# EAGLE design eclaire sub board (EAGLE 7.2.0)
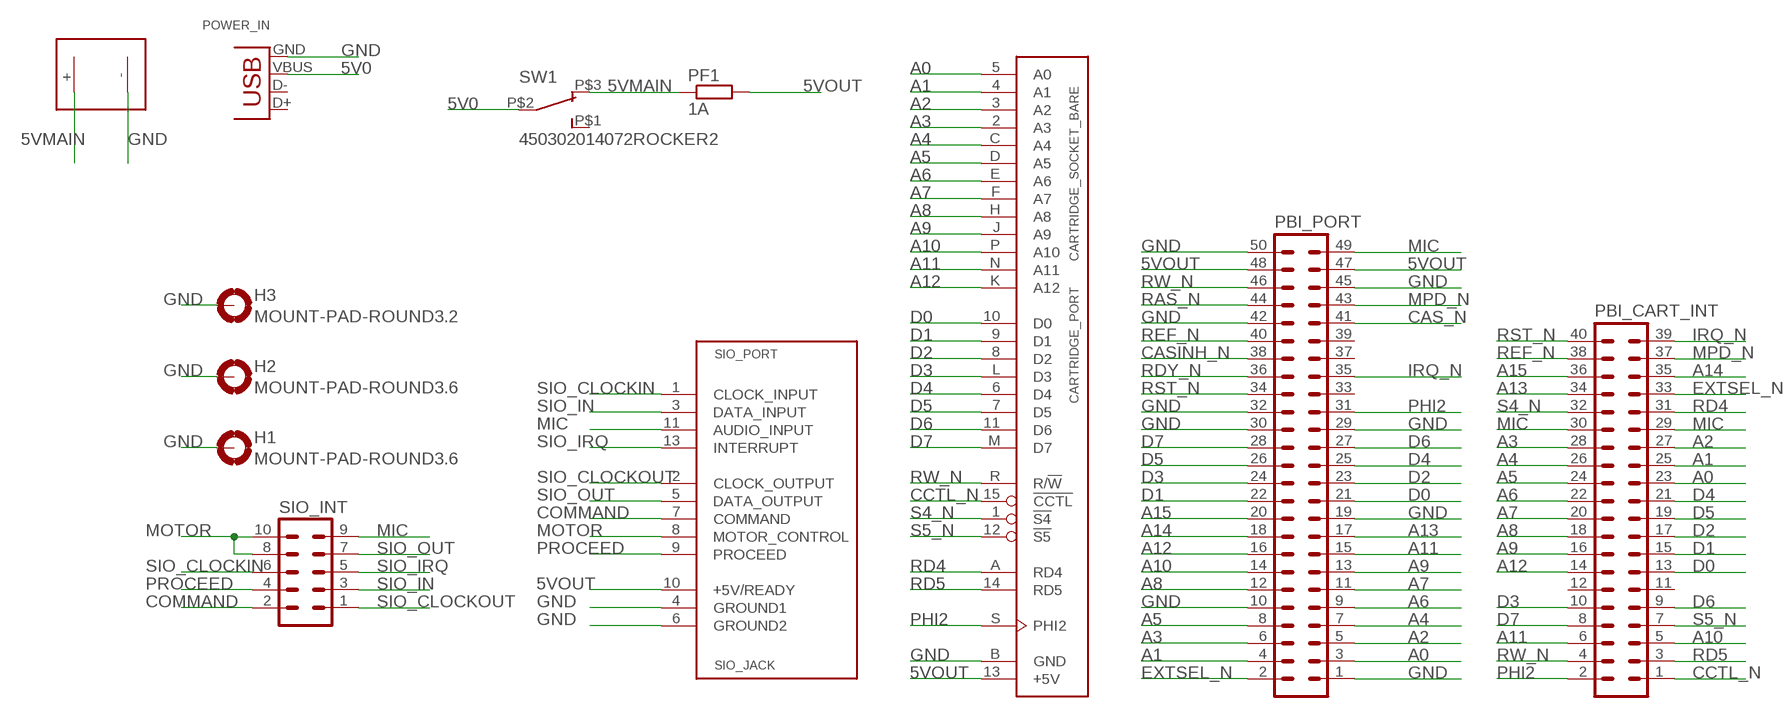
[diagram p0: schematic, sheet 1]

## Parts
CARTRIDGE_PORT  CARTRIDGE_SOCKET_BARE  [CARTRIDGE_SOCKET]
H1  MOUNT-PAD-ROUND3.6  [3,6-PAD]
H2  MOUNT-PAD-ROUND3.6  [3,6-PAD]
H3  MOUNT-PAD-ROUND3.2  [3,2-PAD]
PBI_CART_INT  ML40  [ML40]
PBI_PORT  ML50  [ML50]
PF1  1A  R-EU_R1206  [R1206]
POWER_IN  USB-B-H  [USB-B-H]
SIO_INT  ML10  [ML10]
SIO_PORT  SIO_JACK  [SIO_JACK]
SW1  450302014072ROCKER2  [ROCKER_VERT_SPDT2]
U$6  MOLEX_PS  [MOLEX_PS]

## Nets
5V0 [5V0]: POWER_IN.VBUS SW1.P$2
5VMAIN [5VMAIN]: PF1.1 SW1.P$3 U$6.+
5VOUT [5VOUT]: CARTRIDGE_PORT.13(+5V) PBI_PORT.47 PBI_PORT.48 PF1.2 SIO_PORT.10(+5V/READY)
A0: CARTRIDGE_PORT.5(A0) PBI_CART_INT.23 PBI_PORT.3
A1: CARTRIDGE_PORT.4(A1) PBI_CART_INT.25 PBI_PORT.4
A2: CARTRIDGE_PORT.3(A2) PBI_CART_INT.27 PBI_PORT.5
A3: CARTRIDGE_PORT.2(A3) PBI_CART_INT.28 PBI_PORT.6
A4: CARTRIDGE_PORT.C(A4) PBI_CART_INT.26 PBI_PORT.7
A5: CARTRIDGE_PORT.D(A5) PBI_CART_INT.24 PBI_PORT.8
A6: CARTRIDGE_PORT.E(A6) PBI_CART_INT.22 PBI_PORT.9
A7: CARTRIDGE_PORT.F(A7) PBI_CART_INT.20 PBI_PORT.11
A8: CARTRIDGE_PORT.H(A8) PBI_CART_INT.18 PBI_PORT.12
A9: CARTRIDGE_PORT.J(A9) PBI_CART_INT.16 PBI_PORT.13
A10: CARTRIDGE_PORT.P(A10) PBI_CART_INT.5 PBI_PORT.14
A11: CARTRIDGE_PORT.N(A11) PBI_CART_INT.6 PBI_PORT.15
A12: CARTRIDGE_PORT.K(A12) PBI_CART_INT.14 PBI_PORT.16
A13: PBI_CART_INT.34 PBI_PORT.17
A14: PBI_CART_INT.35 PBI_PORT.18
A15: PBI_CART_INT.36 PBI_PORT.20
CAS_N: PBI_PORT.41
CASINH_N: PBI_PORT.38
CCTL_N: CARTRIDGE_PORT.15(!CCTL) PBI_CART_INT.1
COMMAND: SIO_INT.2 SIO_PORT.7(COMMAND)
D0: CARTRIDGE_PORT.10(D0) PBI_CART_INT.13 PBI_PORT.21
D1: CARTRIDGE_PORT.9(D1) PBI_CART_INT.15 PBI_PORT.22
D2: CARTRIDGE_PORT.8(D2) PBI_CART_INT.17 PBI_PORT.23
D3: CARTRIDGE_PORT.L(D3) PBI_CART_INT.10 PBI_PORT.24
D4: CARTRIDGE_PORT.6(D4) PBI_CART_INT.21 PBI_PORT.25
D5: CARTRIDGE_PORT.7(D5) PBI_CART_INT.19 PBI_PORT.26
D6: CARTRIDGE_PORT.11(D6) PBI_CART_INT.9 PBI_PORT.27
D7: CARTRIDGE_PORT.M(D7) PBI_CART_INT.8 PBI_PORT.28
EXTSEL_N: PBI_CART_INT.33 PBI_PORT.2
GND: CARTRIDGE_PORT.B(GND) H1.B3,6(MOUNT) H2.B3,6(MOUNT) H3.B3,2(MOUNT) PBI_PORT.1 PBI_PORT.10 PBI_PORT.19 PBI_PORT.29 PBI_PORT.30 PBI_PORT.32 PBI_PORT.42 PBI_PORT.45 PBI_PORT.50 POWER_IN.GND SIO_PORT.4(GROUND1) SIO_PORT.6(GROUND2) U$6.-(--)
IRQ_N: PBI_CART_INT.39 PBI_PORT.35
MIC: PBI_CART_INT.29 PBI_CART_INT.30 PBI_PORT.49 SIO_INT.9 SIO_PORT.11(AUDIO_INPUT)
MOTOR: SIO_INT.8 SIO_INT.10 SIO_PORT.8(MOTOR_CONTROL)
MPD_N: PBI_CART_INT.37 PBI_PORT.43
PHI2: CARTRIDGE_PORT.S(PHI2) PBI_CART_INT.2 PBI_PORT.31
PROCEED: SIO_INT.4 SIO_PORT.9(PROCEED)
RAS_N: PBI_PORT.44
RD4: CARTRIDGE_PORT.A(RD4) PBI_CART_INT.31
RD5: CARTRIDGE_PORT.14(RD5) PBI_CART_INT.3
RDY_N: PBI_PORT.36
REF_N: PBI_CART_INT.38 PBI_PORT.40
RST_N: PBI_CART_INT.40 PBI_PORT.34
RW_N: CARTRIDGE_PORT.R(R/!W) PBI_CART_INT.4 PBI_PORT.46
S4_N: CARTRIDGE_PORT.1(!S4) PBI_CART_INT.32
S5_N: CARTRIDGE_PORT.12(!S5) PBI_CART_INT.7
SIO_CLOCKIN: SIO_INT.6 SIO_PORT.1(CLOCK_INPUT)
SIO_CLOCKOUT: SIO_INT.1 SIO_PORT.2(CLOCK_OUTPUT)
SIO_IN: SIO_INT.3 SIO_PORT.3(DATA_INPUT)
SIO_IRQ: SIO_INT.5 SIO_PORT.13(INTERRUPT)
SIO_OUT: SIO_INT.7 SIO_PORT.5(DATA_OUTPUT)
Unconnected: PBI_CART_INT.11 PBI_CART_INT.12 PBI_PORT.33 PBI_PORT.37 PBI_PORT.39 POWER_IN.D+ POWER_IN.D- SW1.P$1

## Library data of the parts
CARTRIDGE_PORT = atari:CARTRIDGE_SOCKET: Cartridge Socket
H1-H3 = holes:MOUNT-PAD-ROUND: MOUNTING PAD, round
PBI_CART_INT = con-ml:ML40: HARTING; OC_FARNELL: unknown; OC_NEWARK: unknown
PBI_PORT = con-ml:ML50: HARTING; OC_FARNELL: unknown; OC_NEWARK: unknown
PF1 = rcl:R-EU_: RESISTOR, European symbol
POWER_IN = con-usb-3:USB: USB Connectors
SIO_INT = con-ml:ML10: HARTING; OC_FARNELL: unknown; OC_NEWARK: unknown
SIO_PORT = atari:SIO_JACK: SIO Jack
SW1 = Eagle_Wuerth_Elektronik_Switch_rev15b:450302014072: WS-SUT, 10mm*2.5mm, SPDT, ON-ON, 2.54mm, right angle type, THT, Mini Slide Switch, 3 pins
U$6 = molex_ps:MOLEX_PS

## Net classes
1 5V0: width 0.61 mm
2 5VOUT: width 0.406 mm
3 5VMAIN: width 0.61 mm

## Board
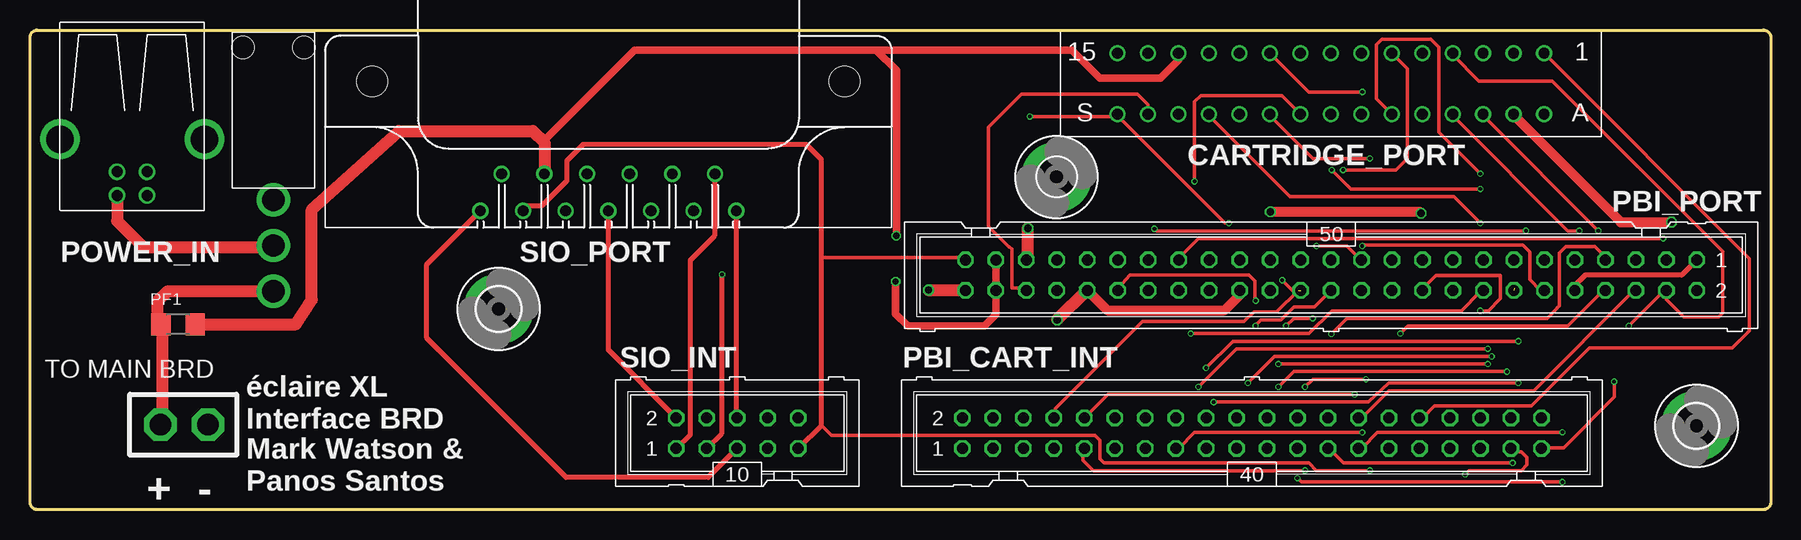
[diagram p1: board, top side]
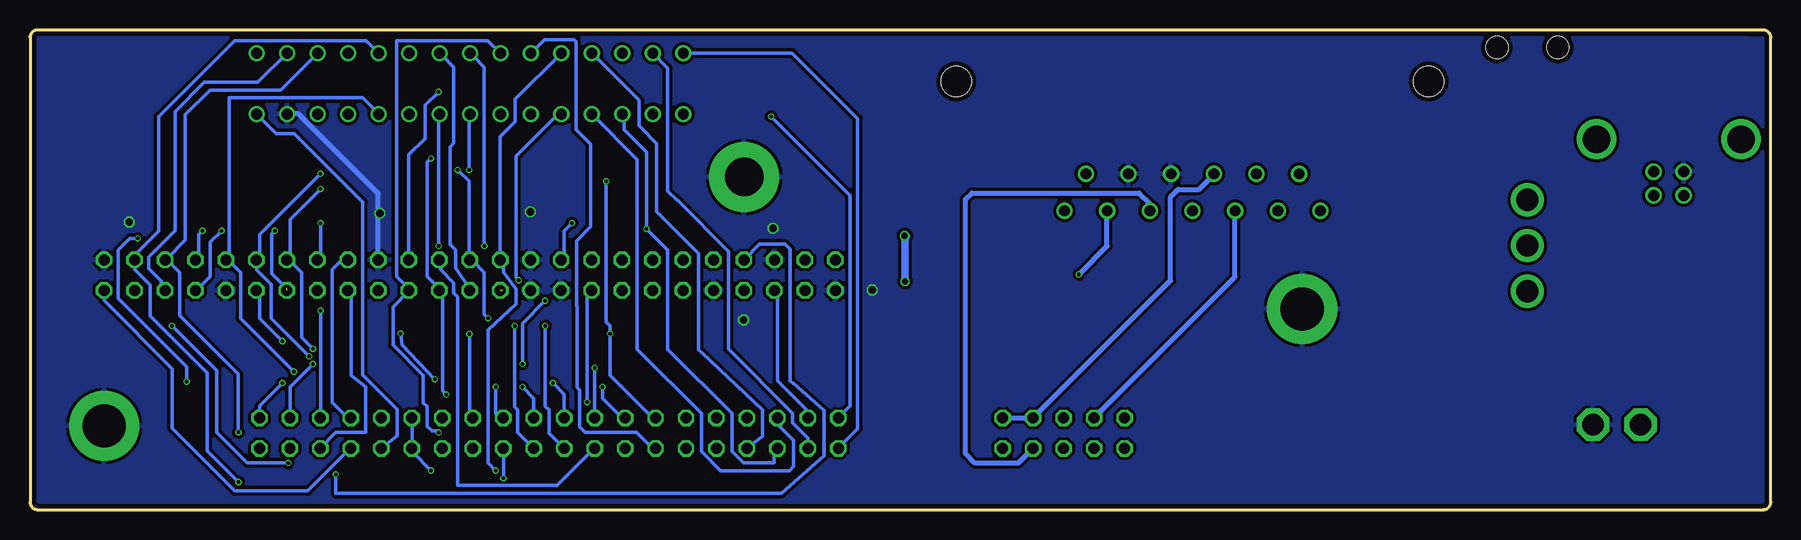
[diagram p2: board, bottom side, seen from below]

Size 145.11 x 40.01 mm. Coordinates in mm from the lower left corner, seen from the top.
Outline: 0.63,40.01 144.47,40.01 arc-90 145.11,39.37 145.11,0.64 arc-90 144.47,0 0.63,0 arc-90 0,0.64 0,39.37 arc-90 0.63,40.01
Copper layers (1*2*15*16): Top 0.035559375mm / dielectric 0.17018125mm / Route2 0.01778125mm / dielectric 47mil / Route15 0.01778125mm / dielectric 0.17018125mm / Bottom 0.035559375mm
Design rules "OSHPark-4layer *": minimum track width 12mil, minimum drill 12mil, track to track 6mil, track to pad 6mil, pad to pad 6mil, via to via 6mil, smd to smd 5mil, copper to edge 15mil, drill to drill 6mil, minimum pad ring 4mil, minimum via ring 4mil, stop-mask expansion 4mil, vias tented up to drill 10mil, thermal gap 10mil

### Footprints (pad centres in the part's own frame; a part is rotated, then mirrored left to right if it is on the bottom)
CARTRIDGE_SOCKET = drill 0.9: 1 17.78,2.54; 2 15.24,2.54; 3 12.7,2.54; 4 10.16,2.54; 5 7.62,2.54; 6 5.08,2.54; 7 2.54,2.54; 8 0,2.54; 9 -2.54,2.54; 10 -5.08,2.54; 11 -7.62,2.54; 12 -10.16,2.54; 13 -12.7,2.54; 14 -15.24,2.54; 15 -17.78,2.54; A 17.78,-2.54; B 15.24,-2.54; C 12.7,-2.54; D 10.16,-2.54; E 7.62,-2.54; F 5.08,-2.54; H 2.54,-2.54; J 0,-2.54; K -2.54,-2.54; L -5.08,-2.54; M -7.62,-2.54; N -10.16,-2.54; P -12.7,-2.54; R -15.24,-2.54; S -17.78,-2.54
3,6-PAD = drill 3.6 pad 5.842: B3,6 0,0
3,2-PAD = drill 3.2 pad 5.842: B3,2 0,0
ML40 = drill 0.914 octagon: 1 -24.13,-1.27; 2 -24.13,1.27; 3 -21.59,-1.27; 4 -21.59,1.27; 5 -19.05,-1.27; 6 -19.05,1.27; 7 -16.51,-1.27; 8 -16.51,1.27; 9 -13.97,-1.27; 10 -13.97,1.27; 11 -11.43,-1.27; 12 -11.43,1.27; 13 -8.89,-1.27; 14 -8.89,1.27; 15 -6.35,-1.27; 16 -6.35,1.27; 17 -3.81,-1.27; 18 -3.81,1.27; 19 -1.27,-1.27; 20 -1.27,1.27; 21 1.27,-1.27; 22 1.27,1.27; 23 3.81,-1.27; 24 3.81,1.27; 25 6.35,-1.27; 26 6.35,1.27; 27 8.89,-1.27; 28 8.89,1.27; 29 11.43,-1.27; 30 11.43,1.27; 31 13.97,-1.27; 32 13.97,1.27; 33 16.51,-1.27; 34 16.51,1.27; 35 19.05,-1.27; 36 19.05,1.27; 37 21.59,-1.27; 38 21.59,1.27; 39 24.13,-1.27; 40 24.13,1.27
ML50 = drill 0.914 octagon: 1 -30.48,-1.27; 2 -30.48,1.27; 3 -27.94,-1.27; 4 -27.94,1.27; 5 -25.4,-1.27; 6 -25.4,1.27; 7 -22.86,-1.27; 8 -22.86,1.27; 9 -20.32,-1.27; 10 -20.32,1.27; 11 -17.78,-1.27; 12 -17.78,1.27; 13 -15.24,-1.27; 14 -15.24,1.27; 15 -12.7,-1.27; 16 -12.7,1.27; 17 -10.16,-1.27; 18 -10.16,1.27; 19 -7.62,-1.27; 20 -7.62,1.27; 21 -5.08,-1.27; 22 -5.08,1.27; 23 -2.54,-1.27; 24 -2.54,1.27; 25 0,-1.27; 26 0,1.27; 27 2.54,-1.27; 28 2.54,1.27; 29 5.08,-1.27; 30 5.08,1.27; 31 7.62,-1.27; 32 7.62,1.27; 33 10.16,-1.27; 34 10.16,1.27; 35 12.7,-1.27; 36 12.7,1.27; 37 15.24,-1.27; 38 15.24,1.27; 39 17.78,-1.27; 40 17.78,1.27; 41 20.32,-1.27; 42 20.32,1.27; 43 22.86,-1.27; 44 22.86,1.27; 45 25.4,-1.27; 46 25.4,1.27; 47 27.94,-1.27; 48 27.94,1.27; 49 30.48,-1.27; 50 30.48,1.27
R1206 = smd 1.6 x 1.803: 1 -1.422,0; 2 1.422,0
USB-B-H = drill 0.914: D+ 0,1.25; D- 1.981,1.25; GND 0,-1.25; VBUS 1.981,-1.25 | drill 2.286: P$1 -2.718,-6.02; P$2 -2.718,6.02
ML10 = drill 0.914 octagon: 1 -5.08,-1.27; 2 -5.08,1.27; 3 -2.54,-1.27; 4 -2.54,1.27; 5 0,-1.27; 6 0,1.27; 7 2.54,-1.27; 8 2.54,1.27; 9 5.08,-1.27; 10 5.08,1.27
SIO_JACK = drill 0.9: 1 -11.938,10.795; 2 -10.16,7.715; 3 -8.382,10.795; 4 -6.604,7.715; 5 -4.826,10.795; 6 -3.048,7.715; 7 -1.27,10.795; 8 0.508,7.715; 9 2.286,10.795; 10 4.064,7.715; 11 5.842,10.795; 12 7.62,7.715; 13 9.398,10.795 | hole 2.54: -20.955,0; 18.415,0
ROCKER_VERT_SPDT2 = drill 1.85: P$1 0,0; P$2 0,-3.81; P$3 0,-7.62 | hole 1.85: 2.54,12.7; -2.54,12.7
MOLEX_PS = drill 1.8 octagon: + 0,0; - 3.96,0

### Placement (x,y rotation side)
CARTRIDGE_PORT  108.43,35.53 0 top
H1  39.07,16.74 0 top
H2  138.91,6.98 0 top
H3  85.57,27.75 0 top
PBI_CART_INT  101.85,6.38 0 top
PBI_PORT  108.46,19.56 180 top
PF1  12.34,15.44 0 top
POWER_IN  8.52,28.18 270 top
SIO_INT  58.95,6.38 0 top
SIO_PORT  46.94,35.71 180 top
SW1  20.29,25.83 0 top
U$6  10.87,7.09 0 top

### Tracks (layer width: path | path; a pad name or v marks a point on that pad's centre or on a via)
5V0
  Top 1.016: POWER_IN.VBUS 7.27,24.08 9.45,21.9 20.17,21.9 SW1.P$2
5VMAIN
  Top 0.61: 11.04,15.32 PF1.1 | 11.04,15.63 PF1.1 | 11.07,15.6 PF1.1
  Top 1.016: SW1.P$3 11.48,18.21 10.62,17.35 10.62,15.75 PF1.1 | 11.04,15.32 11.04,7.25 U$6.+
5VOUT  (via drill 0.51)
  Top 0.61: SIO_PORT.10 42.87,30.81 50.39,38.33 70.54,38.33 | CARTRIDGE_PORT.13 95.73,37.49 94.23,35.99 89.18,35.99 86.84,38.33 70.54,38.33 | PBI_PORT.48 PBI_PORT.47 80.52,16.26 79.58,15.32 73.18,15.32 72.16,16.33 v72.16,19.02 | v72.21,22.83 72.21,36.65 70.54,38.33
  Top 1.016: PF1.2 22.15,15.44 23.49,17.5 23.49,25.02 30.76,31.57 41.94,31.57 42.87,30.63 SIO_PORT.10
  Bottom 0.61: v72.16,19.02 72.16,22.78
  Bottom 0.813: 72.16,22.78 v72.21,22.83
A0  (via drill 0.3)
  Top 0.305: v105.65,2.62 105.97,2.3 v127.74,2.3
  Bottom 0.305: v105.65,2.62 105.65,4.84 PBI_CART_INT.23 | v127.74,2.3 130.35,4.92 130.35,11.4 135.1,16.15 135.1,18.75 136.4,20.04 PBI_PORT.3 136.4,21.23 134.39,23.24 134.39,32.78 128.04,39.13 117.11,39.13 CARTRIDGE_PORT.5
A1  (via drill 0.3)
  Top 0.305: 136.45,18.49 PBI_PORT.4 | v123.58,3.89 109.46,3.89 108.51,4.84 PBI_CART_INT.25 | v133.27,15.32 136.13,18.17 PBI_PORT.4 | PBI_PORT.4 136.4,17.53 137.87,16.05 140.77,16.05 141.12,16.41 141.12,21.51 126.9,35.74 120.79,35.74 118.59,37.94 CARTRIDGE_PORT.4
  Bottom 0.305: v123.58,3.89 127,3.89 129.57,6.45 129.57,11.61 v133.27,15.32
A2  (via drill 0.3)
  Top 0.305: v127.74,6.45 112.32,6.43 111.05,5.16 PBI_CART_INT.27
  Bottom 0.305: v127.74,6.45 127.76,6.48 127.76,11.33 132.64,16.21 132.64,19.76 133.59,20.71 PBI_PORT.5 133.59,21.03 132.16,22.47 132.16,32.94 130.1,35 124.21,35 CARTRIDGE_PORT.3
A3
  Top 0.305: PBI_CART_INT.28 111.05,7.7 113.27,9.92 125.34,9.92 133.59,18.17 PBI_PORT.6
  Bottom 0.305: PBI_PORT.6 134.16,18.59 134.16,19.08 135.2,20.12 135.2,21.08 133.02,23.27 133.02,33.2 130.58,35.64 126.11,35.64 CARTRIDGE_PORT.2
A4  (via drill 0.3)
  Top 0.305: v130.73,23.25 121.21,32.78 CARTRIDGE_PORT.C | v108.48,14.66 109.78,15.95 126.47,15.95 127.33,16.82 127.33,16.84 127.48,16.99 127.48,21.41 128.02,21.95 130.44,21.95 131.05,21.34 131.05,21.09 PBI_PORT.7
  Bottom 0.305: v130.73,23.25 131.05,22.94 131.05,21.03 PBI_PORT.7 | v108.48,14.66 108.48,7.93 PBI_CART_INT.26
A5  (via drill 0.3)
  Top 0.305: v129.15,23.25 128.19,23.25 118.67,32.78 CARTRIDGE_PORT.D | v106.29,10.24 106.92,10.87 v111.37,10.87 | v114.22,14.68 114.86,15.32 128.19,15.32 131.05,18.17 PBI_PORT.8
  Bottom 0.305: v129.15,23.25 130.1,22.3 130.1,19.44 131.05,18.49 PBI_PORT.8 | v106.29,10.24 106.29,8.01 105.97,7.7 PBI_CART_INT.24 | v111.37,10.87 114.1,13.73 v114.22,14.68
A6  (via drill 0.3)
  Top 0.305: v104.06,10.24 105.33,11.51 v123.11,11.51
  Bottom 0.305: CARTRIDGE_PORT.E 116.13,33.1 117.4,34.37 128.51,34.37 128.51,21.03 PBI_PORT.9 128.51,20.71 127.56,19.76 127.56,15.95 v123.11,11.51 | v104.06,10.24 103.12,9.3 PBI_CART_INT.22
A7  (via drill 0.3)
  Top 0.305: v101.52,10.55 103.75,12.78 v121.84,12.78 | v120.89,28.02 117.42,31.48 117.42,38.56 116.76,39.22 112.67,39.22 112.22,38.76 112.22,34.29 CARTRIDGE_PORT.F
  Bottom 0.305: v120.89,28.02 125.97,22.94 125.97,21.03 PBI_PORT.11 126.21,20.8 126.21,19.96 125.02,18.77 125.02,15.95 v121.84,12.78 | v101.52,10.55 100.58,9.61 PBI_CART_INT.20
A8  (via drill 0.3)
  Top 0.305: v98.03,11.82 100.25,14.05 v124.07,14.05 | v111.05,21.98 111.14,22.07 124.43,22.07 125.02,21.49 125.02,19.18 125.91,18.29 PBI_PORT.12
  Bottom 0.305: v111.05,21.98 111.05,32.78 CARTRIDGE_PORT.H | v98.03,11.82 98.03,7.7 PBI_CART_INT.18 | v124.07,14.05 125.97,15.95 125.97,18.17 PBI_PORT.12
A9  (via drill 0.3)
  Top 0.305: v108.51,28.33 110.1,26.75 v120.89,26.75 | v97.4,10.24 100.57,13.41 v121.53,13.41
  Bottom 0.305: v108.51,28.33 108.51,32.78 CARTRIDGE_PORT.J | v120.89,26.75 123.43,24.21 123.43,21.03 PBI_PORT.13 123.43,20.71 122.48,19.76 122.48,14.36 v121.53,13.41 | v97.4,10.24 97.4,9.28 95.81,7.7 PBI_CART_INT.16
A10  (via drill 0.3)  (1 unrouted)
  Top 0.305: v124.7,23.25 93.89,23.25 v93.73,23.42
  Bottom 0.305: PBI_CART_INT.5 83.11,4.84 83.11,3.89 85.65,3.89 86.6,4.84 86.6,8.01 91.95,13.36 91.95,21.64 v93.73,23.42 93.73,29.82 95.61,31.7 95.61,32.87 CARTRIDGE_PORT.P | 123.75,18.49 124.97,19.71 124.97,22.99 v124.7,23.25
A11  (via drill 0.3)
  Top 0.305: v120.89,23.89 118.67,26.11 105.02,26.11 98.35,32.78 CARTRIDGE_PORT.N
  Bottom 0.305: 98.03,32.78 CARTRIDGE_PORT.N 94.49,29.21 94.49,13.36 89.14,8.01 89.14,4.84 87.55,3.25 81.81,3.25 81.46,3.61 81.46,5.77 82.63,6.93 82.63,7.47 PBI_CART_INT.6 | v120.89,23.89 120.89,21.03 PBI_PORT.15
A12  (via drill 0.3)
  Top 0.305: v96.76,14.68 106.6,14.68 108.51,16.59 119.3,16.59 120.89,18.17 PBI_PORT.16 | v97.08,27.38 97.08,34.01 97.61,34.54 104.34,34.54 CARTRIDGE_PORT.K
  Bottom 0.305: PBI_CART_INT.14 93.27,7.7 96.76,11.19 v96.76,14.68 96.76,15.33 97.08,15.65 v97.08,27.38
A13
  Bottom 0.305: PBI_CART_INT.34 118.67,7.7 119.91,8.94 119.91,20.04 119.13,20.83 PBI_PORT.17 118.67,20.71
A14
  Bottom 0.305: PBI_CART_INT.35 120.89,5.16 119.62,6.43 117.14,6.43 117.14,10.24 118.35,11.19 118.35,18.17 PBI_PORT.18
A15  (via drill 0.3)
  Top 0.305: PBI_PORT.20 116.13,18.49 117.17,19.53 122.58,19.53 122.58,17.6 121.56,16.59 v120.89,16.59
  Bottom 0.305: v120.89,16.59 120.89,7.7 PBI_CART_INT.36
CCTL_N
  Bottom 0.305: PBI_CART_INT.1 77.71,5.16 76.12,6.74 76.12,32.61 81.58,38.07 CARTRIDGE_PORT.15
COMMAND
  Top 0.406: SIO_INT.2 48.21,13.31 SIO_PORT.7
D0  (via drill 0.3)
  Top 0.305: v111.06,34.84 106.59,34.84 CARTRIDGE_PORT.10
  Bottom 0.305: PBI_CART_INT.13 93.27,5.16 94.54,6.43 98.83,6.43 99.29,6.88 99.29,9.98 99.49,10.19 99.49,16.92 99.57,16.99 99.57,22.4 98.37,23.6 98.37,30.48 99.29,31.39 99.31,31.39 99.59,31.67 99.59,39.04 99.75,39.19 102.23,39.19 CARTRIDGE_PORT.10 | v111.06,34.84 112.17,33.73 112.17,30.96 113.54,29.59 PBI_PORT.21
D1  (via drill 0.3)
  Top 0.305: PBI_CART_INT.15 95.81,5.16 97.08,6.43 v111.05,6.43
  Bottom 0.305: v111.05,6.43 111.18,6.55 111.61,6.55 112.01,6.96 112.01,8.61 112.32,8.92 112.32,11.19 114.86,13.73 114.86,16.9 113.59,18.17 PBI_PORT.22 113.59,18.49 114.54,19.44 114.54,39.13 106.95,39.13 CARTRIDGE_PORT.9
D2  (via drill 0.3)
  Top 0.305: v107.24,21.98 109.78,21.98 110.73,21.03 PBI_PORT.23
  Bottom 0.305: v107.24,21.98 107.24,36.91 108.19,37.86 CARTRIDGE_PORT.8 | PBI_CART_INT.17 98.35,4.84 101.21,1.98 101.26,2.03 109.47,2.03 109.47,17.75 109.78,18.06 109.78,18.9 110.9,20.02 110.9,20.73 PBI_PORT.23
D3  (via drill 0.3)
  Top 0.305: v111.68,29.29 106.92,29.29 103.43,32.78 CARTRIDGE_PORT.L | v110.41,9.6 89.84,9.6 PBI_CART_INT.10
  Bottom 0.305: v111.68,29.29 112,28.97 112,19.44 111.05,18.49 PBI_PORT.24 110.73,18.17 110.73,9.92 v110.41,9.6
D4  (via drill 0.3)
  Top 0.305: v104.7,15.32 105.33,15.95 v106.92,15.95 | v109.46,28.33 113.86,28.33 114.81,29.29 114.81,36.78 CARTRIDGE_PORT.6
  Bottom 0.305: v109.46,28.33 108.51,27.38 108.51,21.03 PBI_PORT.25 108.19,20.71 107.24,19.76 107.24,16.27 v106.92,15.95 | v104.7,15.32 104.7,8.59 104.44,8.33 104.44,6.43 PBI_CART_INT.21
D5  (via drill 0.3)
  Top 0.305: PBI_PORT.26 107.06,16.89 105.36,16.89 104.27,15.8 102.59,15.8 102.16,15.37 v102.16,15.32
  Bottom 0.305: CARTRIDGE_PORT.7 110.73,37.86 109.78,36.91 109.78,30.56 110.1,30.24 110.1,22.11 109.65,21.67 109.65,20.14 108.51,18.49 PBI_PORT.26 | 100.89,5.16 PBI_CART_INT.19 101.85,6.38 101.85,8.31 102.16,8.61 v102.16,15.32
D6  (via drill 0.3)
  Top 0.305: v106.29,3.25 88.65,3.25 87.78,4.12 87.78,5 PBI_CART_INT.9
  Bottom 0.305: v106.29,3.25 106.92,3.89 106.92,15 104.6,17.15 104.6,18.42 105.65,19.77 105.65,20.71 PBI_PORT.27 105.92,31.12 104.67,32.36 104.67,34.21 CARTRIDGE_PORT.11
D7  (via drill 0.3)  (1 unrouted)
  Top 0.305: PBI_CART_INT.8 85.47,7.77 85.47,8.43 92.71,15.67 101.19,15.67 102.01,16.48 103.91,16.48 105.71,18.29 | v104.38,19.13 105.22,18.29 PBI_PORT.28
  Bottom 0.305: v104.38,19.13 104.6,19.34 104.6,29.49 101.09,32.99 CARTRIDGE_PORT.M
EXTSEL_N
  Bottom 0.305: PBI_CART_INT.33 118.67,4.84 121.96,1.55 128.04,1.55 133.25,6.76 133.25,11.74 138.94,17.42 PBI_PORT.2
GND  (via drill 0.6)
  Top 0.305: 103.43,20.71 PBI_PORT.29
  Top 0.406: 74.9,18.29 74.9,18.24 | PBI_PORT.45 83.18,20.83 | PBI_PORT.1 137.67,19.56 129.64,19.56 128.78,18.69 PBI_PORT.10
  Top 0.61: PBI_PORT.42 88.09,18.29 | 123.67,32.89 CARTRIDGE_PORT.B
  Top 0.813: v103.4,24.84 115.82,24.84 v115.95,24.71 | v136.83,23.98 132.59,23.98 123.67,32.89 | PBI_PORT.42 89.81,16.61 99.57,16.61 100.84,17.88 PBI_PORT.32
  Top 1.016: PBI_PORT.50 74.9,18.29 | 83.18,20.83 v83.18,23.47 | 88.09,18.29 v85.62,15.82
  Bottom 0.406: PBI_PORT.19 116.08,26.34 122.76,33.02 123.55,33.02
  other vias: 74.9,18.31
  pour Bottom (isolate 0.254): 5.71,39.42 144.55,39.42 144.55,0.58 0.63,0.58 0.63,39.24
IRQ_N  (via drill 0.3)
  Top 0.305: v136.13,22.62 97.4,22.62 95.81,21.03 PBI_PORT.35 | PBI_CART_INT.39 126.29,5.16 127.84,5.16 132.08,9.4 132.08,10.64 v132.05,10.67
  Bottom 0.305: v136.13,22.62 136.79,22.62 137.74,21.67 137.74,17.6 132.05,11.91 v132.05,10.67
MIC  (via drill 0.3)
  Top 0.305: 65.96,21.03 77.71,21.03 PBI_PORT.49 | v111.68,3.25 107.24,3.25 106.6,3.89 89.53,3.89 89.2,4.22 89.2,5.77 88.77,6.2 66.8,6.2 65.96,7.04
  Top 0.406: SIO_INT.9 65.96,7.04 65.96,21.03 65.96,29.21 64.72,30.45 46.1,30.45 44.73,29.08 44.73,27.41 42.65,25.32 41.5,25.32 SIO_PORT.11
  Bottom 0.305: PBI_CART_INT.30 113.27,7.38 113.27,5.16 PBI_CART_INT.29 113.27,4.84 v111.68,3.25
MOTOR
  Bottom 0.406: SIO_PORT.8 46.43,27.94 47.68,26.7 49.4,26.7 50.04,26.06 50.04,19.1 SIO_INT.8 SIO_INT.10
MPD_N  (via drill 0.3)
  Top 0.305: v119.62,2.93 119.94,3.25 124.31,3.25 124.79,3.73 124.79,4.34 124.31,4.83 123.72,4.83 PBI_CART_INT.37
  Bottom 0.305: v119.62,2.93 119.62,1.35 82.47,1.35 78.94,4.47 78.94,8.28 81.52,10.55 81.55,10.55 81.74,10.74 81.74,21.72 82.17,22.15 84.28,22.15 PBI_PORT.43 85.33,20.71
PHI2  (via drill 0.3)
  Top 0.305: v99.94,23.89 99.62,23.89 90.73,32.78 CARTRIDGE_PORT.S 90.45,32.79 v83.34,32.79
  Bottom 0.305: v99.94,23.89 100.57,23.25 100.57,21.03 PBI_PORT.31 | PBI_CART_INT.2 77.71,7.7 76.76,8.65 76.76,26.21 v83.34,32.79
PROCEED
  Bottom 0.406: SIO_INT.4 44.65,19.41 SIO_PORT.9
RD4
  Bottom 0.305: PBI_CART_INT.31 115.81,5.16 114.5,6.13 114.5,8.36 117.37,11.23 117.37,25.65 123.09,31.37 124.59,31.37 CARTRIDGE_PORT.A
RD5
  Bottom 0.305: PBI_CART_INT.3 80.26,5.94 81.53,7.21 81.53,8.03 86.89,13.39 86.89,21.54 91.11,25.76 91.13,25.76 91.95,26.57 91.95,36.83 CARTRIDGE_PORT.14
REF_N  (via drill 0.3)
  Top 0.305: v121.53,12.14 v104.06,12.14 | PBI_PORT.40 90.73,18.49 91.68,19.57 101.61,19.57 102.11,19.08 102.11,17.49 v102.17,17.42
  Bottom 0.305: v121.53,12.14 123.43,10.24 123.43,7.7 PBI_CART_INT.38 | v102.17,17.42 104.06,15.53 v104.06,12.14
RST_N  (via drill 0.3)
  Top 0.305: v124.07,10.55 113.27,10.55 111.56,8.97 v98.67,8.97
  Bottom 0.305: v124.07,10.55 125.97,8.65 125.97,7.7 PBI_CART_INT.40 | PBI_PORT.34 98.35,18.17 98.67,17.86 v98.67,8.97
RW_N
  Top 0.305: PBI_PORT.46 82.79,18.49 81.84,18.49 81.84,21.72 81.64,21.92 81.58,21.92 79.88,23.62 79.88,31.9 82.63,34.65 87.83,34.65 88.34,34.65 92.3,34.65 93.19,33.76 CARTRIDGE_PORT.R
  Bottom 0.305: PBI_PORT.46 82.79,18.17 82.79,10.73 80.26,8.2 PBI_CART_INT.4
S4_N
  Top 0.305: 126.29,37.86 CARTRIDGE_PORT.1 143.33,20.96 143.33,14.91 141.91,13.49 129.97,13.49 125.13,8.65 117.08,8.65 116.13,7.7 PBI_CART_INT.32
S5_N
  Bottom 0.305: 98.03,37.86 CARTRIDGE_PORT.12 94.34,34.14 94.34,32.03 94.26,31.95 94.26,31.93 92.86,30.53 92.86,24.84 89.38,21.36 89.38,13.34 89.14,13.09 84.05,8.33 84.05,6.11 85.33,5.16 PBI_CART_INT.7
SIO_CLOCKIN
  Top 0.406: SIO_INT.6 58.88,7.72 SIO_PORT.1
SIO_CLOCKOUT
  Top 0.406: SIO_INT.1 55.04,6.27 55.04,20.8 57.1,22.86 SIO_PORT.2
SIO_IN  (via drill 0.3)
  Top 0.406: SIO_INT.3 57.68,6.38 v57.68,19.61
  Bottom 0.406: v57.68,19.61 55.32,21.97 SIO_PORT.3
SIO_IRQ
  Top 0.406: SIO_INT.5 56.54,2.69 44.68,2.69 33.07,14.3 33.07,20.45 SIO_PORT.13
SIO_OUT
  Bottom 0.406: SIO_INT.7 62.74,3.86 66.32,3.86 67.13,4.67 67.13,25.88 66.6,26.42 52.65,26.42 51.76,25.53 SIO_PORT.5

### Text on the board
tNames: TO MAIN BRD | éclaire XL / Interface BRD | Mark Watson & / Panos Santos | + | -